# Altium schematic sheet SENS.SchDoc: Motherboard-SENS
size A4; Author: Patryk Bujak; DrawnBy: Patryk Bujak; DocumentNumber: 12; Revision: 1.0; SheetNumber: 2; SheetTotal: 10
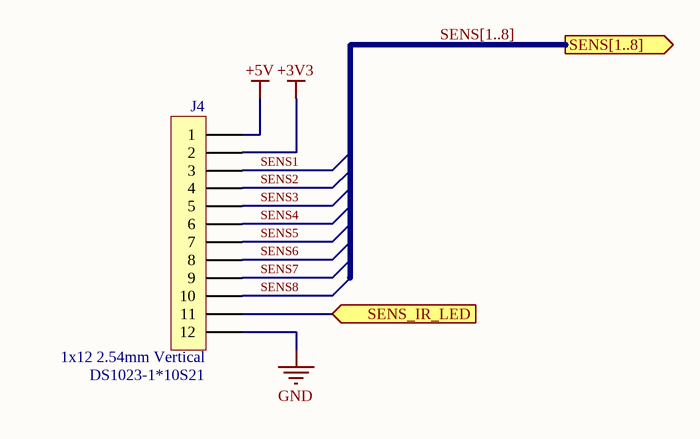
[diagram p0: SENS.SchDoc]

## Parts
J4  value DS1023-1*10S21  SCH_Footprint: 1x12 2.54mm Vertical  [J_HEADER_1x12_2.54_VERTICAL]  (hidden comment: Goldpin female straight)

## Ports
SENS[1..8] (out), SENS_IR_LED (in)

## Nets
+3V3: J4.2
+5V: J4.1
GND: J4.12
SENS1: J4.3
SENS2: J4.4
SENS3: J4.5
SENS4: J4.6
SENS5: J4.7
SENS6: J4.8
SENS7: J4.9
SENS8: J4.10
SENS_IR_LED: J4.11 ; port SENS_IR_LED

## Buses and harness runs
bus SENS[1..8] = port SENS[1..8]

## Notes on the sheet
- Title
- Size:
- Date:
- A4
- Number:
- Time:
- Revision:
- Sheet
- of
- File:

## Library data of the parts
J4 = J_HEADER_1x12_2.54_VERTICAL: Pin Header; Manufacturer: Connfly; Part Number: J_HEADER_1x12_2.54_VERTICAL; HelpURL: https://www.tme.eu/Document/efd0203e2d3a140765df98191085ea88/DS1023.pdf; Manufacturer Part Number: DS1023-1*10S21; Supplier 1: TME; Supplier Part Number 1: ZL262-10SG; Supplier 2: RS Components; Supplier 3: Farnell; Supplier 4: Mouser; Supplier 5: Digi-Key; Supplier 6: LCSC